# EAGLE design SPWLMS (EAGLE 7.5.0)
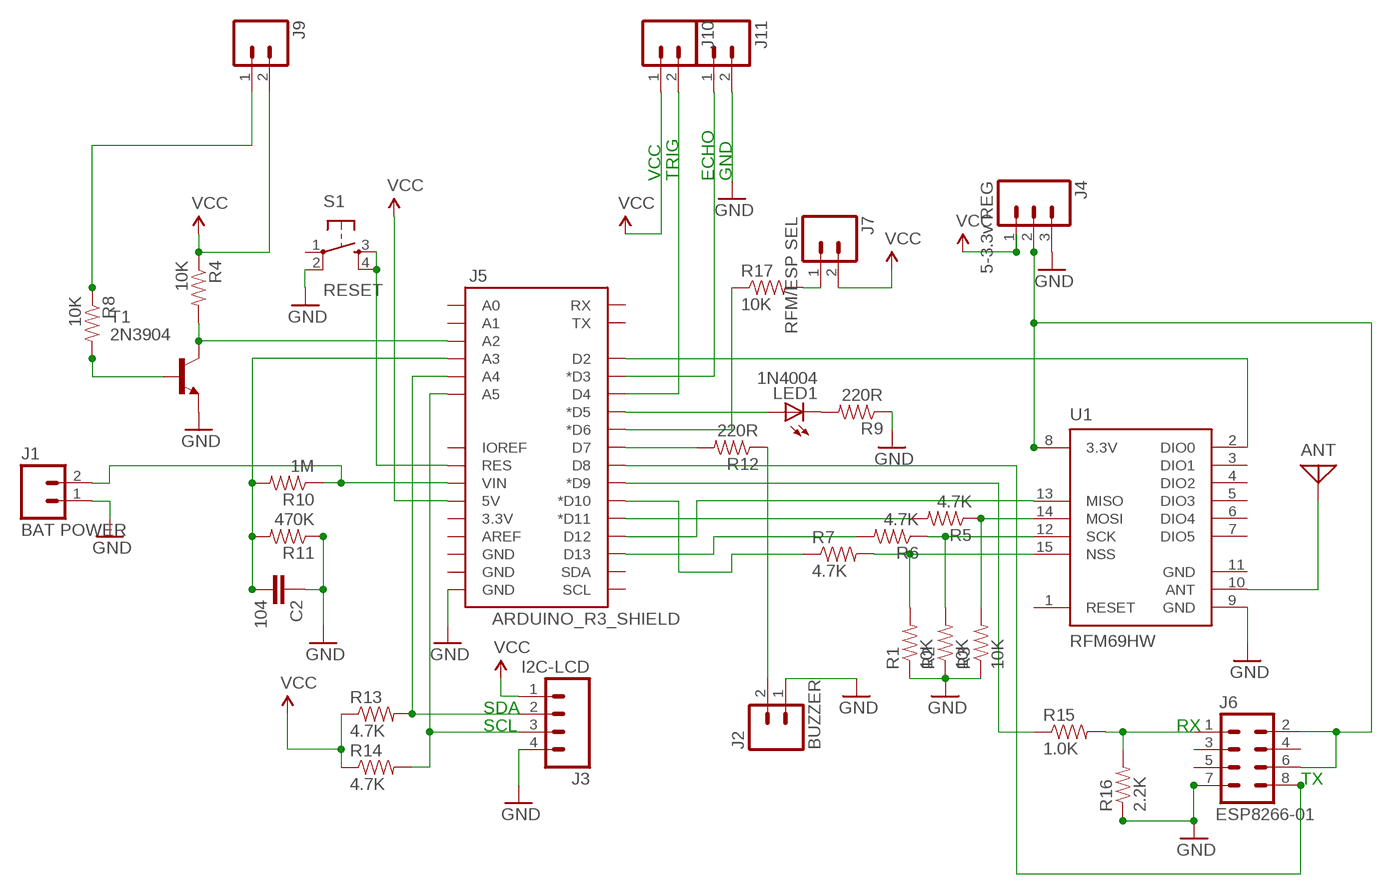
[diagram p0: schematic, sheet 1]

## Parts
ANT  ANTENNA  [PAD-01]
C2  104  C2.5/4  [C2.5-4]
J1  BAT POWER  M02PTH  [1X02]
J2  BUZZER  M02PTH  [1X02]
J3  I2C-LCD  M04NO_SILK_ALL_ROUND  [1X04_NO_SILK_ALL_ROUND]
J4  5-3.3v REG  M03LOCK  [1X03_LOCK]
J5  ARDUINO_R3_SHIELD  [UNO_R3_SHIELD]
J6  ESP8266-01  M04X2  [2X4]
J7  RFM/ESP SEL  M02PTH  [1X02]
J9  M025MM  [SCREWTERMINAL-5MM-2]
J10  M025MM  [SCREWTERMINAL-5MM-2]
J11  M025MM  [SCREWTERMINAL-5MM-2]
LED1  1N4004  LED5MM  [LED5MM]
R1  10K  RESISTORPTH-1/4W  [AXIAL-0.4]
R2  10K  RESISTORPTH-1/4W  [AXIAL-0.4]
R3  10K  RESISTORPTH-1/4W  [AXIAL-0.4]
R4  10K  RESISTORPTH-1/4W  [AXIAL-0.4]
R5  4.7K  RESISTORPTH-1/4W  [AXIAL-0.4]
R6  4.7K  RESISTORPTH-1/4W  [AXIAL-0.4]
R7  4.7K  RESISTORPTH-1/4W  [AXIAL-0.4]
R8  10K  RESISTORPTH-1/4W  [AXIAL-0.4]
R9  220R  RESISTORPTH-1/4W  [AXIAL-0.4]
R10  1M  RESISTORPTH-1/4W  [AXIAL-0.4]
R11  470K  RESISTORPTH-1/4W  [AXIAL-0.4]
R12  220R  RESISTORPTH-1/4W  [AXIAL-0.4]
R13  4.7K  RESISTORPTH-1/4W  [AXIAL-0.4]
R14  4.7K  RESISTORPTH-1/4W  [AXIAL-0.4]
R15  1.0K  RESISTORPTH-1/4W  [AXIAL-0.4]
R16  2.2K  RESISTORPTH-1/4W  [AXIAL-0.4]
R17  10K  RESISTORPTH-1/4W  [AXIAL-0.4]
S1  RESET  TAC_SWITCHPTH  [TACTILE-PTH]
T1  2N3904  [TO92]
U1  RFM69HW  [RFM69W-XXXS2]

## Nets
GND: C2.1 J1.1 J2.1 J3.4 J4.3 J5.GND@0(GND) J6.7 J11.2 R1.P$1 R2.P$1 R3.P$1 R9.P$1 R11.P$1 R16.P$1 S1.2 T1.3(E) U1.9(GND)
N$1: J5.D12 U1.13(MISO)
N$2: J5.D11(*D11) R5.P$2
N$3: R3.P$2 R5.P$1 U1.14(MOSI)
N$4: J5.D13 R6.P$2
N$5: R2.P$2 R6.P$1 U1.12(SCK)
N$6: R1.P$2 R7.P$2 U1.15(NSS)
N$7: J5.D10(*D10) R7.P$1
N$8: J5.D5(*D5) LED1.A
N$9: J4.2 J6.2 J6.6 U1.8(3.3V)
N$10: J5.D2 U1.2(DIO0)
N$11: ANT.1 U1.10(ANT)
N$12: J5.A2 R4.P$2 T1.1(C)
N$13: C2.2 J5.A3 R10.P$2 R11.P$2
N$14: R8.P$2 T1.2(B)
N$15: J9.1 R8.P$1
N$16: LED1.K(C) R9.P$2
N$17: J3.2 J5.A4 R13.P$2
N$18: J5.D4 J10.2
N$19: J5.D3(*D3) J11.1
N$20: J1.2 J5.VIN R10.P$1
N$21: J5.D7 R12.P$2
N$22: J2.2 R12.P$1
N$23: J3.3 J5.A5 R14.P$2
N$24: J5.RES S1.3 S1.4
N$25: J5.D9(*D9) R15.P$1
N$26: J6.1 R15.P$2 R16.P$2
N$27: J5.D8 J6.8
N$28: J5.D6(*D6) R17.P$1
N$29: J7.1 R17.P$2
VCC: J3.1 J4.1 J5.5V J7.2 J9.2 J10.1 R4.P$1 R13.P$1 R14.P$1
Unconnected: J5.3.3V J5.A0 J5.A1 J5.AREF J5.GND@1(GND) J5.GND@2(GND) J5.IOREF J5.RX J5.SCL J5.SDA J5.TX J6.3 J6.4 J6.5 S1.1 U1.1(RESET) U1.3(DIO1) U1.4(DIO2) U1.5(DIO3) U1.6(DIO4) U1.7(DIO5)

## Notes on the sheet
- VCC | TRIG | ECHO | GND
- SDA
- SCL | RX
- TX

## Power pins joined to a net without a drawn wire
GND: U1.11(GND)

## Library data of the parts
ANT = discrete:ANTENNA: Antenna
C2 = capacitor-wima:C: CAPACITOR naming: grid - package width
J1 J2 J7 = SparkFun-Connectors:M02: Standard 2-pin 0.1" header. Use with - straight break away headers ( PRT-00116) - right angle break away headers (PRT-00553) - swiss pins (PRT-00743) - machine pins (PRT-00117) - female headers (PRT-00115) Molex polarized connector foot print use with: PRT-08233 with associated crimp pins and housings. 2.54_SCREWTERM for use with PRT-10571. 3.5mm Screw Terminal footprints for PRT-08084 5mm Screw Terminal footprints for use with PRT-08432
J3 = SparkFun-Connectors:M04: Header 4 Standard 4-pin 0.1" header. Use with straight break away headers (SKU : PRT-00116), right angle break away headers (PRT-00553), swiss pins (PRT-00743), machine pins (PRT-00117), and female headers (PRT-00115). Molex polarized connector foot print use with SKU : PRT-08231 with associated crimp pins and housings. 1MM SMD Version SKU: PRT-10208; PROD_ID: CONN-09696
J4 = SparkFun-Connectors:M03: Header 3 Standard 3-pin 0.1" header. Use with straight break away headers (SKU : PRT-00116), right angle break away headers (PRT-00553), swiss pins (PRT-00743), machine pins (PRT-00117), and female headers (PRT-00115). Molex polarized connector foot print use with SKU : PRT-08232 with associated crimp pins and housings.
J5 = SparkFun-Boards:ARDUINO_R3_SHIELD: Shield form compatible with the Arduino Uno R3.
J6 = SparkFun-Connectors:M04X2: .1" header, two rows of four.
J9-J11 = SparkFun-Connectors:M02: Standard 2-pin 0.1" header. Use with - straight break away headers ( PRT-00116) - right angle break away headers (PRT-00553) - swiss pins (PRT-00743) - machine pins (PRT-00117) - female headers (PRT-00115) Molex polarized connector foot print use with: PRT-08233 with associated crimp pins and housings. 2.54_SCREWTERM for use with PRT-10571. 3.5mm Screw Terminal footprints for PRT-08084 5mm Screw Terminal footprints for use with PRT-08432; STOREFRONT_ID: PRT-08432
LED1 = led:LED: LED OSRAM: - CHIPLED LG R971, LG N971, LY N971, LG Q971, LY Q971, LO R971, LY R971 LH N974, LH R974 LS Q976, LO Q976, LY Q976 LO Q996 - Hyper CHIPLED LW Q18S LB Q993, LB Q99A, LB R99A - SideLED LS A670, LO A670, LY A670, LG A670, LP A670 LB A673, LV A673, LT A673, LW A673 LH A674 LY A675 LS A676, LA A676, LO A676, LY A676, LW A676 LS A679, LY A679, LG A679 - Hyper Micro SIDELED® LS Y876, LA Y876, LO Y876, LY Y876 LT Y87S - SmartLED LW L88C, LW L88S LB L89C, LB L89S, LG L890 LS L89K, LO L89K, LY L89K LS L896, LA L896, LO L896, LY L896 - TOPLED LS T670, LO T670, LY T670, LG T670, LP T670 LSG T670, LSP T670, LSY T670, LOP T670, LYG T670 LG T671, LOG T671, LSG T671 LB T673, LV T673, LT T673, LW T673 LH T674 LS T676, LA T676, LO T676, LY T676, LB T676, LH T676, LSB T676, LW T676 LB T67C, LV T67C, LT T67C, LS T67K, LO T67K, LY T67K, LW E67C LS E67B, LA E67B, LO E67B, LY E67B, LB E67C, LV E67C, LT E67C LW T67C LS T679, LY T679, LG T679 LS T770, LO T770, LY T770, LG T770, LP T770 LB T773, LV T773, LT T773, LW T773 LH T774 LS E675, LA E675, LY E675, LS T675 LS T776, LA T776, LO T776, LY T776, LB T776 LHGB T686 LT T68C, LB T68C - Hyper Mini TOPLED® LB M676 - Mini TOPLED Santana® LG M470 LS M47K, LO M47K, LY M47K Source: http://www.osram.convergy.de LUXEON: - LUMILED® LXK2-PW12-R00, LXK2-PW12-S00, LXK2-PW14-U00, LXK2-PW14-V00 LXK2-PM12-R00, LXK2-PM12-S00, LXK2-PM14-U00 LXK2-PE12-Q00, LXK2-PE12-R00, LXK2-PE12-S00, LXK2-PE14-T00, LXK2-PE14-U00 LXK2-PB12-K00, LXK2-PB12-L00, LXK2-PB12-M00, LXK2-PB14-N00, LXK2-PB14-P00, LXK2-PB14-Q00 LXK2-PR12-L00, LXK2-PR12-M00, LXK2-PR14-Q00, LXK2-PR14-R00 LXK2-PD12-Q00, LXK2-PD12-R00, LXK2-PD12-S00 LXK2-PH12-R00, LXK2-PH12-S00 LXK2-PL12-P00, LXK2-PL12-Q00, LXK2-PL12-R00 Source: www.luxeon.com KINGBRIGHT: KA-3528ASYC Source: www.kingbright.com
R1-R17 = SparkFun-Passives:RESISTOR: Resistor Basic schematic elements and footprints for 0603, 1206, and PTH resistors.
S1 = SparkFun-Retired:TAC_SWITCH: Momentary Switch Button commonly used for reset or general input. Spark Fun Electronics SKU : COM-00097 SMT- SWCH-08247
T1 = transistor:2N3904: NPN TRANSISTOR
U1 = SparkFun-RF:RFM69H

## Net classes
0 default: clearance 0.205 mm

## Board
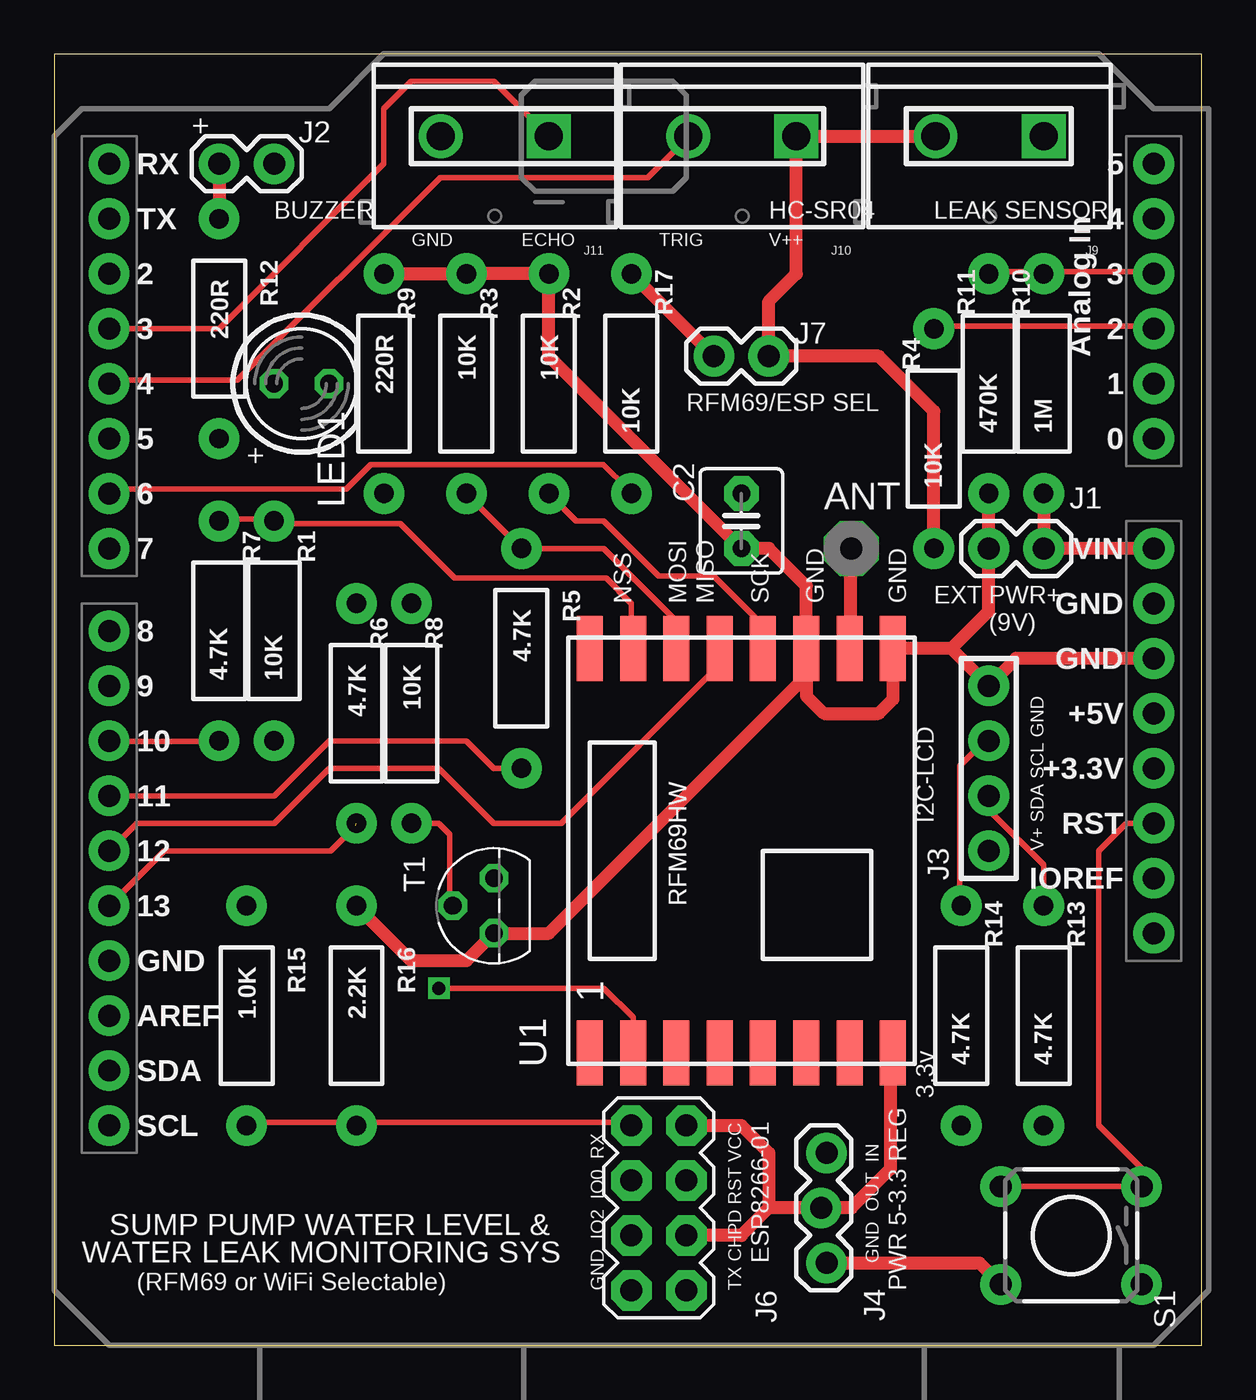
[diagram p1: board, top side]
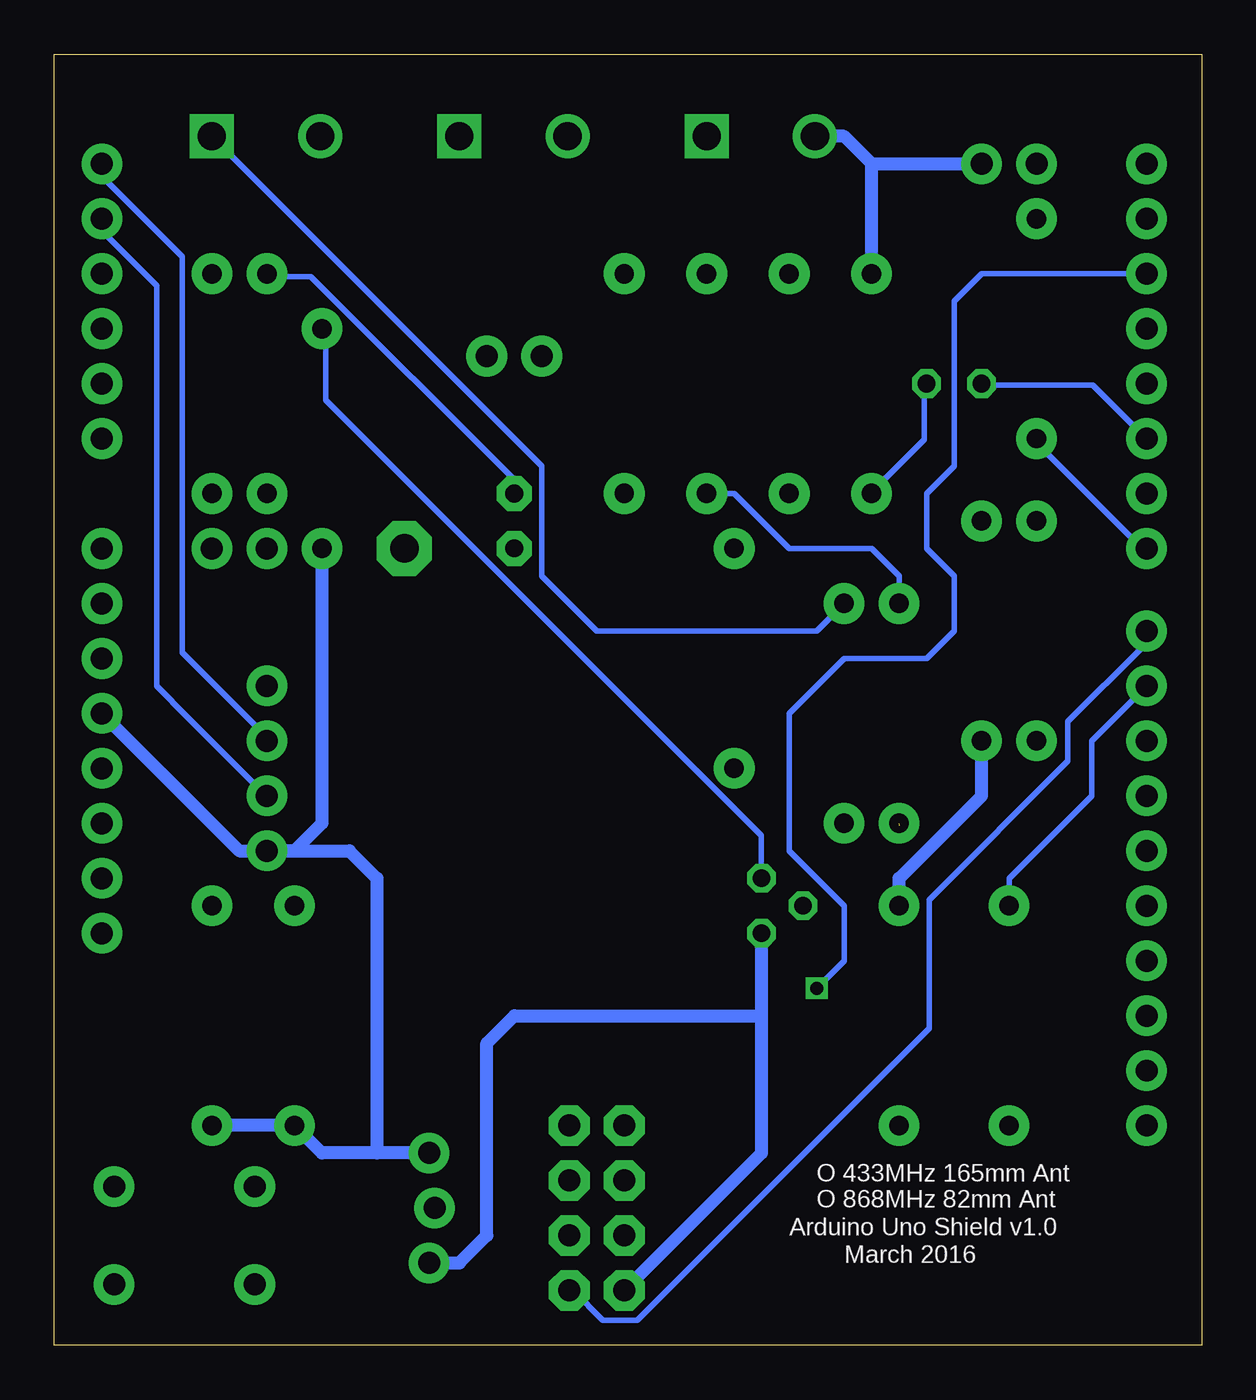
[diagram p2: board, bottom side, seen from below]

Size 53.01 x 59.68 mm. Coordinates in mm from the lower left corner, seen from the top.
Outline: 0,0 53.01,0 53.01,59.68 0,59.68 0,0
Copper layers (1*16): Top 0.035mm / dielectric 1.5mm / Bottom 0.035mm
Design rules "default": minimum track width 10mil, minimum drill 24mil, track to track 8mil, track to pad 8mil, pad to pad 8mil, via to via 8mil, smd to smd 8mil, copper to edge 40mil, drill to drill 8mil, minimum pad ring 10mil, minimum via ring 8mil, stop-mask expansion 4mil, vias tented up to drill 0mil, thermal gap 10mil

### Footprints (pad centres in the part's own frame; a part is rotated, then mirrored left to right if it is on the bottom)
PAD-01 = drill 1.321 pad 2.54 octagon: 1 0,0
C2.5-4 = drill 0.813 pad 1.6 octagon: 1 -1.27,0; 2 1.27,0
1X02 = drill 1.016 pad 1.88: 1 0,0; 2 2.54,0
1X04_NO_SILK_ALL_ROUND = drill 1.016 pad 1.88: 1 0,0; 2 2.54,0; 3 5.08,0; 4 7.62,0
1X03_LOCK = drill 1.016 pad 1.88: 1 0,0.127; 2 2.54,-0.127; 3 5.08,0.127
UNO_R3_SHIELD = drill 1.016 pad 1.88: 3.3V 50.8,26.67; 5V 50.8,29.21; A0 50.8,41.91; A1 50.8,44.45; A2 50.8,46.99; A3 50.8,49.53; A4 50.8,52.07; A5 50.8,54.61; AREF 2.54,15.24; D2 2.54,49.53; D3 2.54,46.99; D4 2.54,44.45; D5 2.54,41.91; D6 2.54,39.37; D7 2.54,36.83; D8 2.54,33.02; D9 2.54,30.48; D10 2.54,27.94; D11 2.54,25.4; D12 2.54,22.86; D13 2.54,20.32; GND@0 50.8,31.75; GND@1 50.8,34.29; GND@2 2.54,17.78; IOREF 50.8,21.59; NC 50.8,19.05; RES 50.8,24.13; RX 2.54,54.61; SCL 2.54,10.16; SDA 2.54,12.7; TX 2.54,52.07; VIN 50.8,36.83
2X4 = drill 1.016 pad 1.88 octagon: 1 -3.81,-1.27; 2 -3.81,1.27; 3 -1.27,-1.27; 4 -1.27,1.27; 5 1.27,-1.27; 6 1.27,1.27; 7 3.81,-1.27; 8 3.81,1.27
SCREWTERMINAL-5MM-2 = drill 1.3 pad 2.032 square: 1 0,0 | drill 1.3 pad 2.032: 2 5,0
LED5MM = drill 0.813 octagon: A -1.27,0; K 1.27,0
AXIAL-0.4 = drill 0.9 pad 1.88: P$1 -5.08,0; P$2 5.08,0
TACTILE-PTH = drill 1.016 pad 1.88: 1 -3.251,2.261; 2 3.251,2.261; 3 -3.251,-2.261; 4 3.251,-2.261
TO92 = drill 0.813 octagon: 1 1.27,0; 2 0,1.905; 3 -1.27,0
RFM69W-XXXS2 = smd 3 x 1.2: 1 -9.35,7; 2 -9.35,5; 3 -9.35,3; 4 -9.35,1; 5 -9.35,-1; 6 -9.35,-3; 7 -9.35,-5; 8 -9.35,-7; 9 9.35,-7; 10 9.35,-5; 11 9.35,-3; 12 9.35,-1; 13 9.35,1; 14 9.35,3; 15 9.35,5; 16 9.35,7

### Placement (x,y rotation side)
ANT  36.83,36.83 0 top
C2  31.75,38.1 90 top
J1  43.18,36.83 0 top
J2  10.16,54.61 180 top
J3  43.18,22.86 90 top
J4  35.56,8.89 270 top
J5  0,0 0 top
J6  27.94,6.35 270 top
J7  30.48,45.72 0 top
J9  45.72,55.88 180 top
J10  34.29,55.88 180 top
J11  22.86,55.88 180 top
LED1  11.43,44.45 0 top
R1  10.16,33.02 90 top
R2  22.86,44.45 270 top
R3  19.05,44.45 270 top
R4  40.64,41.91 90 top
R5  21.59,31.75 270 top
R6  13.97,29.21 270 top
R7  7.62,33.02 90 top
R8  16.51,29.21 270 top
R9  15.24,44.45 270 top
R10  45.72,44.45 90 top
R11  43.18,44.45 90 top
R12  7.62,46.99 270 top
R13  45.72,15.24 90 top
R14  41.91,15.24 90 top
R15  8.89,15.24 270 top
R16  13.97,15.24 270 top
R17  26.67,44.45 90 top
S1  46.99,5.08 180 top
T1  20.32,20.32 90 top
U1  31.75,22.86 90 top

### Tracks (layer width: path | path; a pad name or v marks a point on that pad's centre or on a via)
GND
  Top 0.254: 38.86,32.03 U1.9 | 42.98,36.83 J1.1 | 31.55,36.83 C2.1
  Top 0.61: J5.GND@0 44.45,31.75 J3.4 41.45,32.21 | 41.45,32.21 U1.9 38.75,29.86 38.1,29.21 35.56,29.21 34.75,30.02 U1.11 | 41.45,32.21 43.18,33.94 J1.1 R11.P$1 | U1.11 34.75,30.94 22.86,19.05 T1.3 19.05,17.78 16.51,17.78 R16.P$1 | 31.55,36.83 31.55,37.03 22.86,45.72 R2.P$1 R3.P$1 R9.P$1 | J4.3 42.75,3.81 S1.2 | U1.11 34.75,35.1 33.02,36.83 C2.1
  Bottom 0.61: R9.P$1 15.24,54.61 | 15.24,54.61 16.51,55.88 J11.2 | 15.24,54.61 J2.1 | J6.7 20.32,8.89 20.32,15.24 | 20.32,15.24 T1.3 | J4.3 34.29,3.81 33.02,5.08 33.02,13.97 31.75,15.24 20.32,15.24 | R16.P$1 13.97,21.59 10.16,25.4 R1.P$1
N$1
  Top 0.254: U1.13 30.63,32.03 30.63,31.34 23.42,24.13 20.32,24.13 17.78,26.67 12.7,26.67 10.16,24.13 3.81,24.13 J5.D12
N$2
  Top 0.254: J5.D11 10.16,25.4 12.7,27.94 19.05,27.94 20.32,26.67 R5.P$2
N$3
  Top 0.254: U1.14 28.75,33.48 25.4,36.83 R5.P$1 R3.P$2
N$4  (1 unrouted)
  Top 0.254: 13.95,24.03 12.78,22.86 5.08,22.86 J5.D13
N$5
  Top 0.254: 33.02,32.48 U1.12 32.75,33.29 30.48,35.56 27.94,35.56 25.4,38.1 24.13,38.1 R2.P$2
  Bottom 0.254: 22.86,39.34 R2.P$2 21.59,39.37 19.05,36.83 15.24,36.83 13.97,35.56 R6.P$1
N$6
  Top 0.254: U1.15 26.75,32.26 26.75,32.94 26.67,33.02 26.67,34.29 25.5,35.46 18.52,35.46 16,37.97 10.29,37.97 R1.P$2 10.06,38.2 7.77,38.2 R7.P$2
N$7
  Top 0.254: J5.D10 2.74,27.91 7.54,27.91 R7.P$1
N$8
  Bottom 0.254: LED1.A 10.06,44.37 5.03,44.37 2.74,42.09 J5.D5
N$9
  Top 0.254: 38.63,13.28 U1.8
  Top 0.61: 38.63,13.28 38.63,8.15 36.83,6.35 J4.2 33.02,6.35 | 33.02,6.35 31.75,5.08 J6.6 | J6.2 31.75,10.16 33.02,8.89 33.02,6.35
N$10  (via drill 0.6)
  Top 0.254: v17.78,16.51 25.4,16.51 26.75,15.16 U1.2
  Bottom 0.254: J5.D2 10.16,49.53 11.43,48.26 11.43,40.64 12.7,39.37 12.7,36.83 11.43,35.56 11.43,33.02 12.7,31.75 16.51,31.75 19.05,29.21 19.05,22.86 16.51,20.32 16.51,17.78 v17.78,16.51
N$11
  Top 0.254: 36.8,32.26 U1.10
  Top 0.61: 36.8,32.26 36.8,36.8 ANT.1
N$12
  Top 0.254: J5.A2 50.75,47.12 40.69,47.12 R4.P$2
  Bottom 0.254: T1.1 20.34,21.74 20.34,23.57 40.46,43.69 40.46,46.89 R4.P$2
N$13
  Top 0.254: 45.72,49.63 43.2,49.63 R11.P$2 | 45.72,49.63 50.75,49.63 J5.A3 | 45.72,49.63 R10.P$2
  Bottom 0.254: C2.2 31.77,39.57 31.77,40.03 41.15,49.4 42.98,49.4 R11.P$2
N$14
  Top 0.254: T1.2 18.29,20.37 18.29,23.62 17.78,24.13 R8.P$2
N$15
  Bottom 0.254: J9.1 30.48,40.64 30.48,35.56 27.94,33.02 17.78,33.02 R8.P$1
N$16
  Bottom 0.254: LED1.K 12.8,44.37 12.8,41.86 15.09,39.57 R9.P$2
N$17
  Top 0.254: R13.P$2 45.72,22.2 43.2,24.71 43.2,25.4 J3.2
  Bottom 0.254: J5.A4 50.75,51.92 50.75,51.46 48.26,48.97 48.26,30.48 47.55,29.77 47.55,29.74 43.2,25.4 J3.2
N$18
  Top 0.254: J5.D4 2.74,44.6 8.46,44.6 17.83,53.98 27.43,53.98 29.26,55.8 J10.2
N$19
  Top 0.254: J11.1 20.32,58.42 16.51,58.42 15.24,57.15 15.24,54.61 7.62,46.99 J5.D3
N$20
  Top 0.61: R10.P$1 J1.2 J5.VIN
N$21
  Bottom 0.254: J5.D7 2.74,36.83 7.77,41.86 R12.P$2
N$22
  Top 0.61: J2.2 R12.P$1
N$23
  Top 0.254: R14.P$2 41.83,20.37 41.83,26.77 42.98,27.91 J3.3
  Bottom 0.254: J5.A5 50.75,54.43 50.75,53.98 47.09,50.32 47.09,32.03 43.2,28.14 J3.3
N$24
  Top 0.254: J5.RES 49.53,24.13 48.26,22.86 48.26,10.16 50.24,8.18 S1.3 S1.4
N$25
  Bottom 0.254: J5.D9 5.08,27.94 5.08,25.4 8.89,21.59 R15.P$1
N$26
  Top 0.254: R15.P$2 8.91,10.31 13.95,10.31 R16.P$2 14.17,10.31 26.52,10.31 J6.1
N$27
  Bottom 0.254: J5.D8 2.74,32.94 2.74,32.26 6.17,28.83 6.17,27 12.57,20.6 12.57,14.66 26.06,1.17 27.66,1.17 29.03,2.54 J6.8
N$28
  Top 0.254: J5.D6 2.74,39.57 13.49,39.57 14.63,40.72 25.38,40.72 26.52,39.57 R17.P$1
N$29
  Top 0.61: R17.P$2 J7.1
VCC
  Top 0.61: R4.P$1 40.64,43.18 38.1,45.72 J7.2 33.02,48.26 34.29,49.53 J10.1 J9.2
  Bottom 0.254: 43.2,22.88 J3.1
  Bottom 0.61: J5.5V 44.45,22.86 J3.1 | R4.P$1 40.64,24.13 41.91,22.86 J3.1 | R13.P$1 R14.P$1 40.64,8.89 38.1,8.89 | J4.1 38.1,8.89 | J3.1 39.37,22.86 38.1,21.59 38.1,8.89

### Text on the board
tNames: + | BUZZER | HC-SR04 | LEAK SENSOR | GND | ECHO | TRIG | V++ | RFM69/ESP SEL | + | NSS | MOSI | MISO | SCK | GND | GND | EXT PWR+ | (9V) | I2C-LCD | V+ SDA SCL GND | RFM69HW | RFM69HW | 3.3v | SUMP PUMP WATER LEVEL & | WATER LEAK MONITORING SYS | ESP8266-01 | GND OUT IN | (RFM69 or WiFi Selectable) | GND IO2 IO0 RX | TX CHPD RST VCC | PWR 5-3.3 REG
bNames: O 433MHz 165mm Ant / O 868MHz 82mm Ant | Arduino Uno Shield v1.0 | March 2016